# EAGLE design button_control_esp32 (EAGLE 9.4.2)

## Sheet 1 of 7
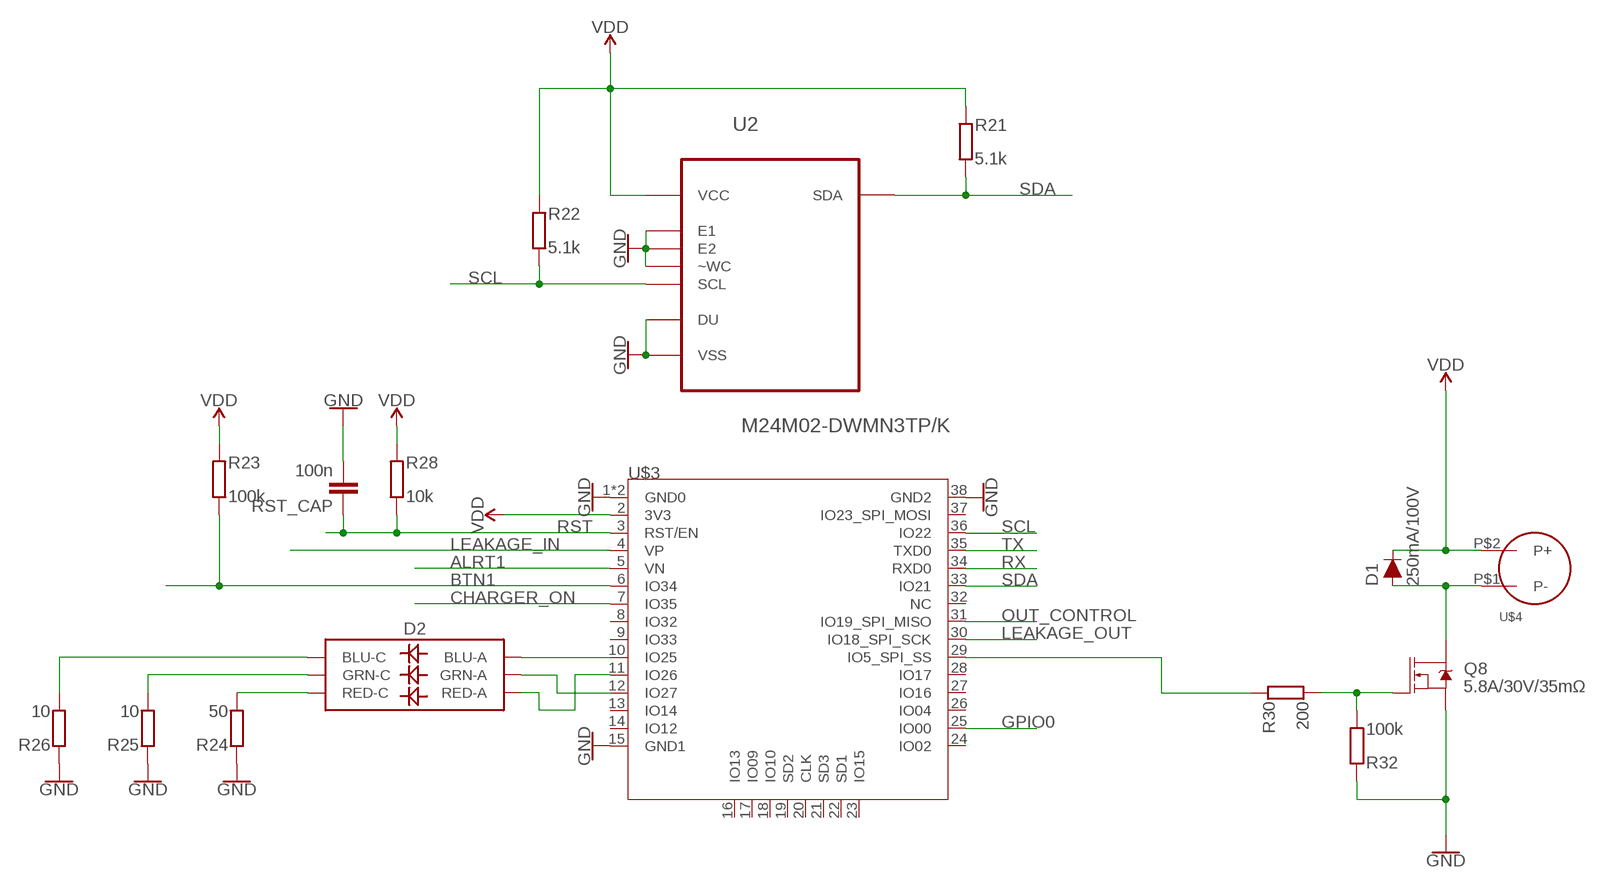
[diagram p0: schematic, sheet 1]

### Parts
D1  250mA/100V  DIODE-BAS16J  [SOD-323]
D2  LED-RGBNO_IC  [LED-TRICOLOR-5050]
Q8  5.8A/30V/35mΩ  MOSFET-NCH-AO3404A  [SOT23-3]
R21  5.1k  R-EU_R0603  [R0603]
R22  5.1k  R-EU_R0603  [R0603]
R23  100k  R-EU_R0603  [R0603]
R24  50  R-EU_R0603  [R0603]
R25  10  R-EU_R0603  [R0603]
R26  10  R-EU_R0603  [R0603]
R28  10k  R-EU_R0603  [R0603]
R30  200  R-EU_R0603  [R0603]
R32  100k  R-EU_R0603  [R0603]
RST_CAP  100n  C-EUC0603  [C0603]
U2  M24M02-DWMN3TP/K  [SOIC127P600X175-8N]
U$3  ESP32  [TTGO_ESP32]
U$4  VIBRO  [VIBRO]

### Nets
ALRT1: U$3.5(VN) ; also sheet 5
BTN1: R23.1 U$3.6(IO34) ; also sheet 7
CHARGER_ON: U$3.7(IO35) ; also sheet 6
GND [PWR]: Q8.2(S) R24.2 R25.2 R26.2 R32.2 RST_CAP.2 U2.1(DU) U2.2(E1) U2.3(E2) U2.4(VSS) U2.7(~WC) U$3.1(GND0) U$3.15(GND1) U$3.38(GND2) U$3.P$1(GND0) ; also sheet 2,3,4,6,7
GPIO0: U$3.25(IO00) ; also sheet 7
LEAKAGE_IN: U$3.4(VP) ; also sheet 3
LEAKAGE_OUT: U$3.30(IO18_SPI_SCK) ; also sheet 3
N$4: D2.3(BLU-A) U$3.10(IO25)
N$12: D2.1(GRN-A) U$3.12(IO27)
N$19: D2.2(RED-A) U$3.11(IO26)
N$24: Q8.1(G) R30.1 R32.1
N$30: R30.2 U$3.29(IO5_SPI_SS)
N$31: D2.4(BLU-C) R26.1
N$33: D2.6(GRN-C) R25.1
N$34: D2.5(RED-C) R24.1
N$35: D1.A Q8.3(D) U$4.P$1(P-)
OUT_CONTROL: U$3.31(IO19_SPI_MISO) ; also sheet 6
RST: R28.1 RST_CAP.1 U$3.3(RST/EN) ; also sheet 2,7
RX: U$3.34(RXD0) ; also sheet 7
SCL: R22.1 U2.6(SCL) U$3.36(IO22) ; also sheet 5
SDA: R21.1 U2.5(SDA) U$3.33(IO21) ; also sheet 5
TX: U$3.35(TXD0) ; also sheet 7
VDD [PWR]: D1.C R21.2 R22.2 R23.2 R28.2 U2.8(VCC) U$3.2(3V3) U$4.P$2(P+) ; also sheet 2,3,5,6,7
Unconnected: U$3.8(IO32) U$3.9(IO33) U$3.13(IO14) U$3.14(IO12) U$3.16(IO13) U$3.17(IO09) U$3.18(IO10) U$3.19(SD2) U$3.20(CLK) U$3.21(SD3) U$3.22(SD1) U$3.23(IO15) U$3.24(IO02) U$3.26(IO04) U$3.27(IO16) U$3.28(IO17) U$3.32(NC) U$3.37(IO23_SPI_MOSI)

## Sheet 2 of 7: POWER
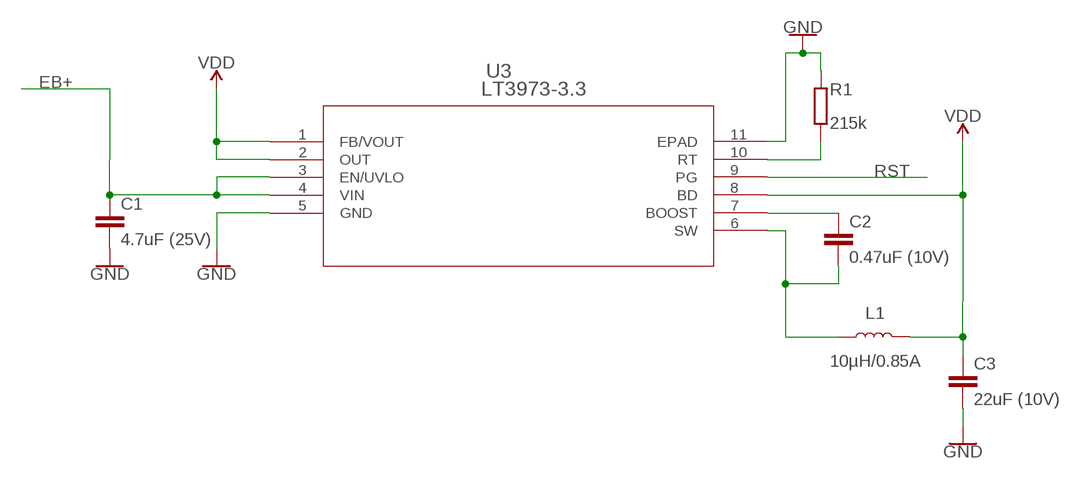
[diagram p1: schematic, sheet 2]

### Parts
C1  4.7uF (25V)  C-EUC1206  [C1206]
C2  0.47uF (10V)  C-EUC0603K  [C0603K]
C3  22uF (10V)  C-EUC1206  [C1206]
L1  10µH/0.85A  INDUCTOR-CDRH-4.7UH  [INDUCTOR_4.7UH]
R1  215k  R-EU_R0603  [R0603]
U3  LT3973-3.3  LT3973IDDPBF  [DFN-10_DD]

### Nets
BOOST: C2.1 U3.7(BOOST)
EB+: C1.1 U3.3(EN/UVLO) U3.4(VIN) ; also sheet 3,4,6,7
GND [PWR]: C1.2 C3.2 R1.2 U3.5(GND) U3.11(EPAD) ; also sheet 1,3,4,6,7
RST: U3.9(PG) ; also sheet 1,7
RT: R1.1 U3.10(RT)
SW [PWR]: C2.2 L1.P$1 U3.6(SW)
VDD [PWR]: C3.1 L1.P$2 U3.1(FB/VOUT) U3.2(OUT) U3.8(BD) ; also sheet 1,3,5,6,7

## Sheet 3 of 7: LEAKAGE
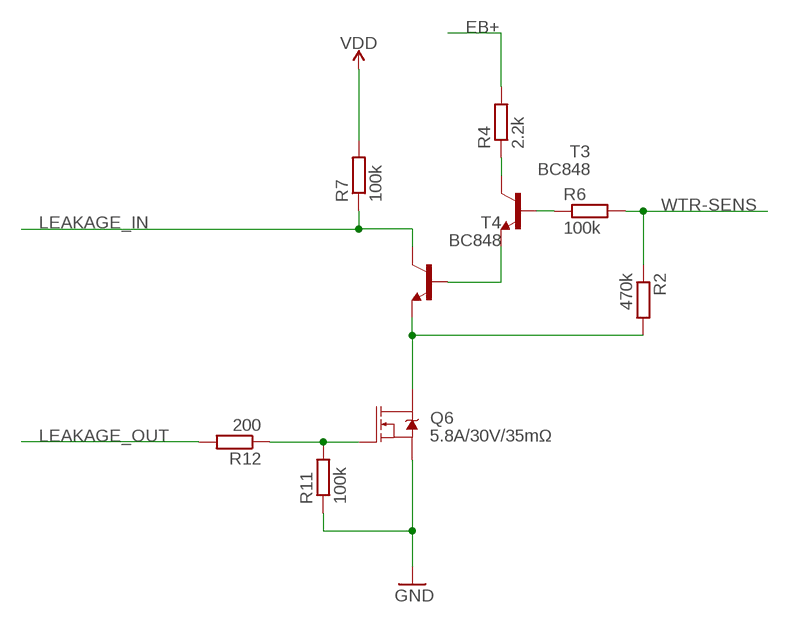
[diagram p2: schematic, sheet 3]

### Parts
Q6  5.8A/30V/35mΩ  MOSFET-NCH-AO3404A  [SOT23-3]
R2  470k  R-EU_R0603  [R0603]
R4  2.2k  R-EU_R0603  [R0603]
R6  100k  R-EU_R0603  [R0603]
R7  100k  R-EU_R0603  [R0603]
R11  100k  R-EU_R0603  [R0603]
R12  200  R-EU_R0603  [R0603]
T3  BC848  [SOT23]
T4  BC848  [SOT23]

### Nets
EB+: R4.2 ; also sheet 2,4,6,7
GND [PWR]: Q6.2(S) R11.1 ; also sheet 1,2,4,6,7
LEAKAGE_IN: R7.1 T4.3(C) ; also sheet 1
LEAKAGE_OUT: R12.2 ; also sheet 1
N$1: T3.2(E) T4.1(B)
N$2: R6.1 T3.1(B)
N$3: Q6.3(D) R2.2 T4.2(E)
VDD [PWR]: R7.2 ; also sheet 1,2,5,6,7
WTR-SENS: R2.1 R6.2 ; also sheet 7
WTR_MEASURE_ON1: Q6.1(G) R11.2 R12.1
WTR_MEASURE_PULLUP1: R4.1 T3.3(C)

## Sheet 4 of 7: BMS
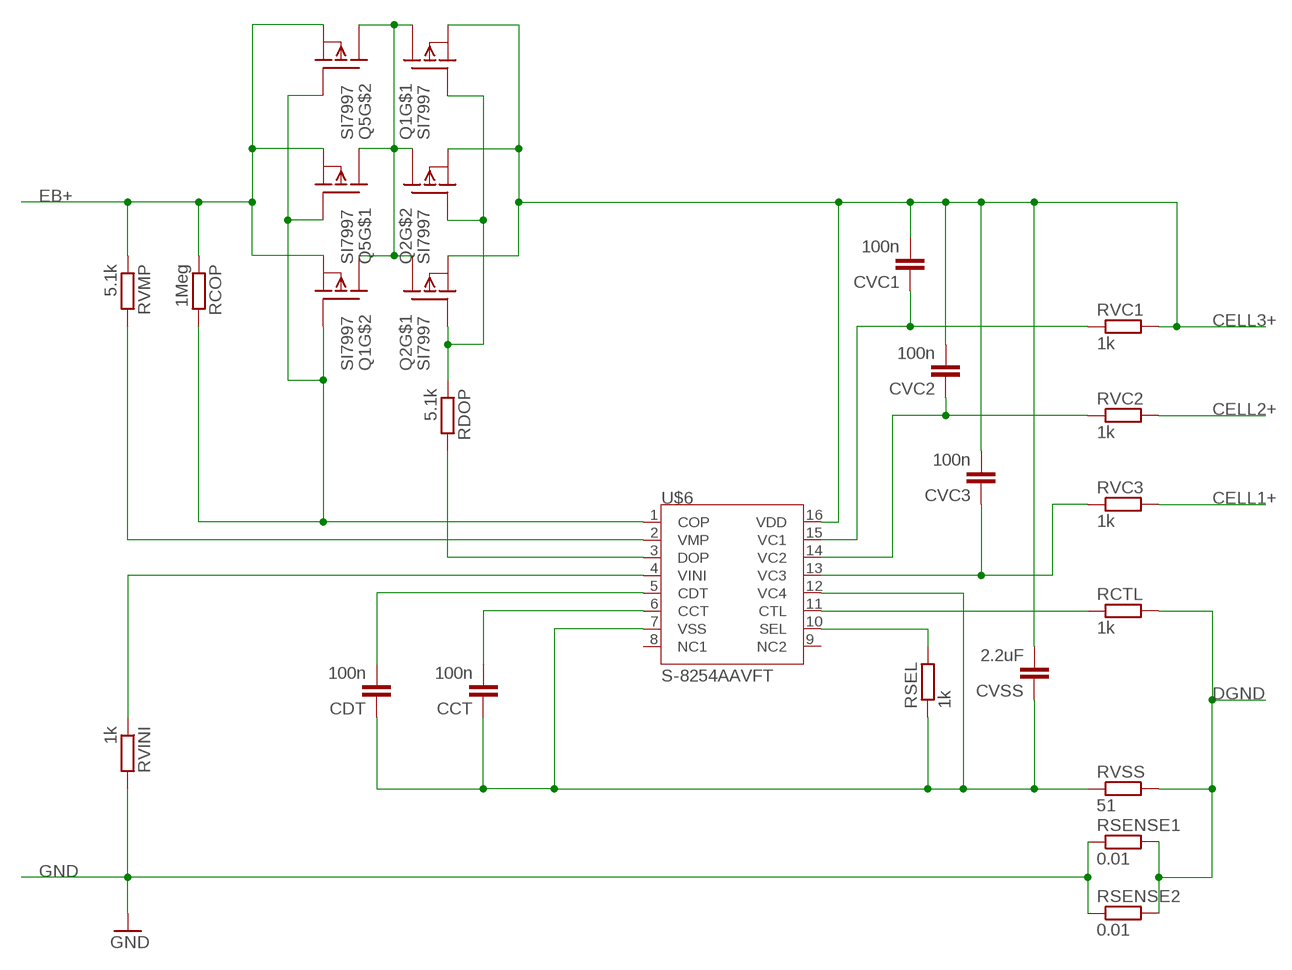
[diagram p3: schematic, sheet 4]

### Parts
CCT  100n  C-EUC0603  [C0603]
CDT  100n  C-EUC0603  [C0603]
CVC1  100n  C-EUC0603  [C0603]
CVC2  100n  C-EUC0603  [C0603]
CVC3  100n  C-EUC0603  [C0603]
CVSS  2.2uF  C-EUC0805  [C0805]
Q1  SI7997  [POWERPAK]
Q2  SI7997  [POWERPAK]
Q5  SI7997  [POWERPAK]
RCOP  1Meg  R-EU_R0603  [R0603]
RCTL  1k  R-EU_R0603  [R0603]
RDOP  5.1k  R-EU_R0603  [R0603]
RSEL  1k  R-EU_R0603  [R0603]
RSENSE1  0.01  R-EU_R2512  [R2512]
RSENSE2  0.01  R-EU_R2512  [R2512]
RVC1  1k  R-EU_R0603  [R0603]
RVC2  1k  R-EU_R0603  [R0603]
RVC3  1k  R-EU_R0603  [R0603]
RVINI  1k  R-EU_R0603  [R0603]
RVMP  5.1k  R-EU_R0603  [R0603]
RVSS  51  R-EU_R0603  [R0603]
U$6  S-8254AAVFT  S-8254A  [TSSOP-16]

### Nets
CELL1+: RVC3.2 ; also sheet 5,7
CELL2+: RVC2.2 ; also sheet 5,7
CELL3+: CVC1.2 CVC2.2 CVC3.2 CVSS.2 Q1.1(S) Q2.1(S) Q2.3(S) RVC1.2 U$6.16(VDD) ; also sheet 5,7
DGND: RCTL.2 RSENSE1.2 RSENSE2.2 RVSS.2 ; also sheet 5,7
EB+: Q1.3(S) Q5.1(S) Q5.3(S) RCOP.1 RVMP.1 ; also sheet 2,3,6,7
GND [PWR]: RSENSE1.1 RSENSE2.1 RVINI.2 ; also sheet 1,2,3,6,7
N$8: RDOP.2 U$6.3(DOP)
N$9: Q1.4(G) Q5.2(G) Q5.4(G) RCOP.2 U$6.1(COP)
N$10: Q1.2(G) Q2.2(G) Q2.4(G) RDOP.1
N$17: RVMP.2 U$6.2(VMP)
N$18: RSEL.2 U$6.10(SEL)
N$20: RVINI.1 U$6.4(VINI)
N$21: CDT.2 U$6.5(CDT)
N$22: CCT.2 U$6.6(CCT)
N$23: CCT.1 CDT.1 CVSS.1 RSEL.1 RVSS.1 U$6.7(VSS) U$6.12(VC4)
N$25: RCTL.1 U$6.11(CTL)
N$26: Q1.5(D) Q1.5_6(D) Q1.6(D) Q1.7(D) Q1.7_8(D) Q1.8(D) Q2.5(D) Q2.5_6(D) Q2.6(D) Q2.7(D) Q2.7_8(D) Q2.8(D) Q5.5(D) Q5.5_6(D) Q5.6(D) Q5.7(D) Q5.7_8(D) Q5.8(D)
N$27: CVC3.1 RVC3.1 U$6.13(VC3)
N$28: CVC2.1 RVC2.1 U$6.14(VC2)
N$29: CVC1.1 RVC1.1 U$6.15(VC1)
Unconnected: U$6.8(NC1) U$6.9(NC2)

## Sheet 5 of 7: GAUGE
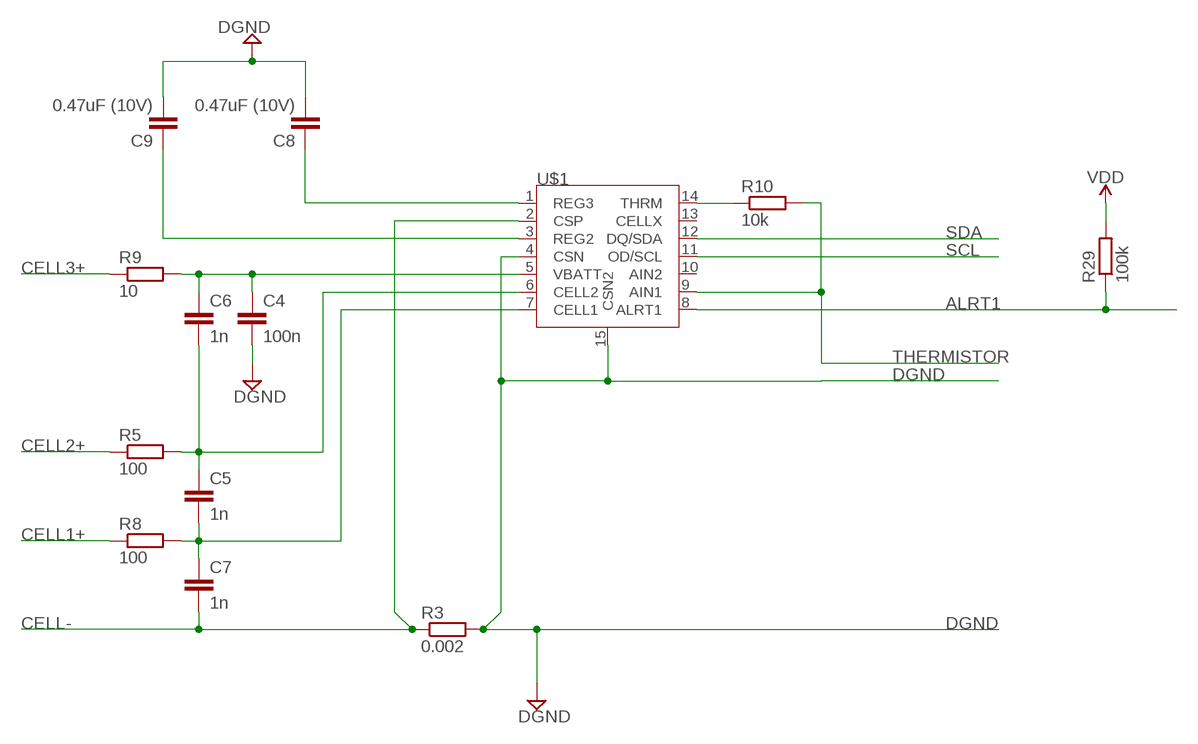
[diagram p4: schematic, sheet 5]

### Parts
C4  100n  C-EUC0603  [C0603]
C5  1n  C-EUC0603  [C0603]
C6  1n  C-EUC0603  [C0603]
C7  1n  C-EUC0603  [C0603]
C8  0.47uF (10V)  C-EUC0603K  [C0603K]
C9  0.47uF (10V)  C-EUC0603K  [C0603K]
R3  0.002  R-EU_R2512  [R2512]
R5  100  R-EU_R0805  [R0805]
R8  100  R-EU_R0805  [R0805]
R9  10  R-EU_R0603  [R0603]
R10  10k  R-EU_R0603  [R0603]
R29  100k  R-EU_R0603  [R0603]
U$1  MAX17205G  [SON40P300X300X80-15N230X170]

### Nets
ALRT1: R29.1 U$1.8(ALRT1) ; also sheet 1
CELL1+: R8.1 ; also sheet 4,7
CELL2+: R5.1 ; also sheet 4,7
CELL3+: R9.1 ; also sheet 4,7
CELL-: C7.2 R3.1 U$1.2(CSP) ; also sheet 7
DGND: C4.2 C8.2 C9.2 R3.2 U$1.4(CSN) U$1.15(CSN2) ; also sheet 4,7
N$5: C4.1 C6.1 R9.2 U$1.5(VBATT)
N$6: C5.1 C6.2 R5.2 U$1.6(CELL2)
N$7: C5.2 C7.1 R8.2 U$1.7(CELL1)
N$11: R10.1 U$1.14(THRM)
N$13: C8.1 U$1.1(REG3)
N$14: C9.1 U$1.3(REG2)
SCL: U$1.11(OD/SCL) ; also sheet 1
SDA: U$1.12(DQ/SDA) ; also sheet 1
THERMISTOR: R10.2 U$1.9(AIN1) ; also sheet 7
VDD [PWR]: R29.2 ; also sheet 1,2,3,6,7
Unconnected: U$1.10(AIN2) U$1.13(CELLX)

## Sheet 6 of 7: SWITCH
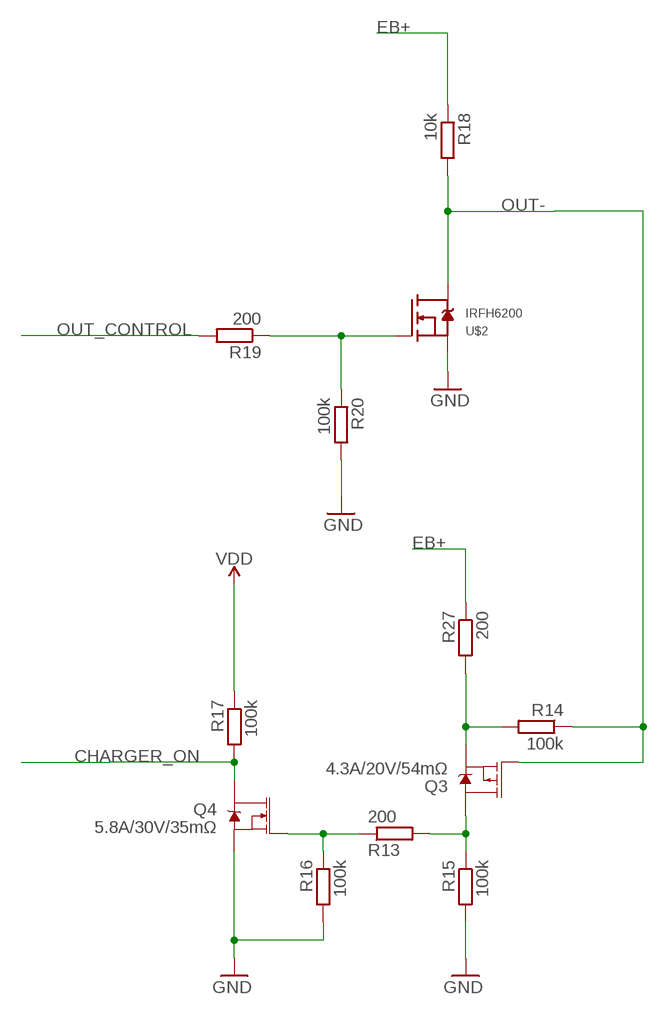
[diagram p5: schematic, sheet 6]

### Parts
Q3  4.3A/20V/54mΩ  MOSFET_PCH-IRLML2244  [SOT23-3]
Q4  5.8A/30V/35mΩ  MOSFET-NCH-AO3404A  [SOT23-3]
R13  200  R-EU_R0603  [R0603]
R14  100k  R-EU_R0603  [R0603]
R15  100k  R-EU_R0603  [R0603]
R16  100k  R-EU_R0603  [R0603]
R17  100k  R-EU_R0603  [R0603]
R18  10k  R-EU_R0603  [R0603]
R19  200  R-EU_R0603  [R0603]
R20  100k  R-EU_R0603  [R0603]
R27  200  R-EU_R0603  [R0603]
U$2  IRFH6200  [PQFN]

### Nets
CHARGER_ON: Q4.3(D) R17.2 ; also sheet 1
EB+: R18.1 R27.1 ; also sheet 2,3,4,7
GND [PWR]: Q4.2(S) R15.2 R16.2 R20.2 U$2.1(S) U$2.2(S) U$2.3(S) ; also sheet 1,2,3,4,7
N$15: Q3.3(D) R13.2 R15.1
N$16: Q4.1(G) R13.1 R16.1
N$32: Q3.2(S) R14.2 R27.2
OUT-: Q3.1(G) R14.1 R18.2 U$2.5(D) U$2.6(D) U$2.7(D) U$2.8(D) U$2.9(D) ; also sheet 7
OUT_BASE: R19.1 R20.1 U$2.4(G)
OUT_CONTROL: R19.2 ; also sheet 1
VDD [PWR]: R17.1 ; also sheet 1,2,3,5,7

## Sheet 7 of 7: CONN
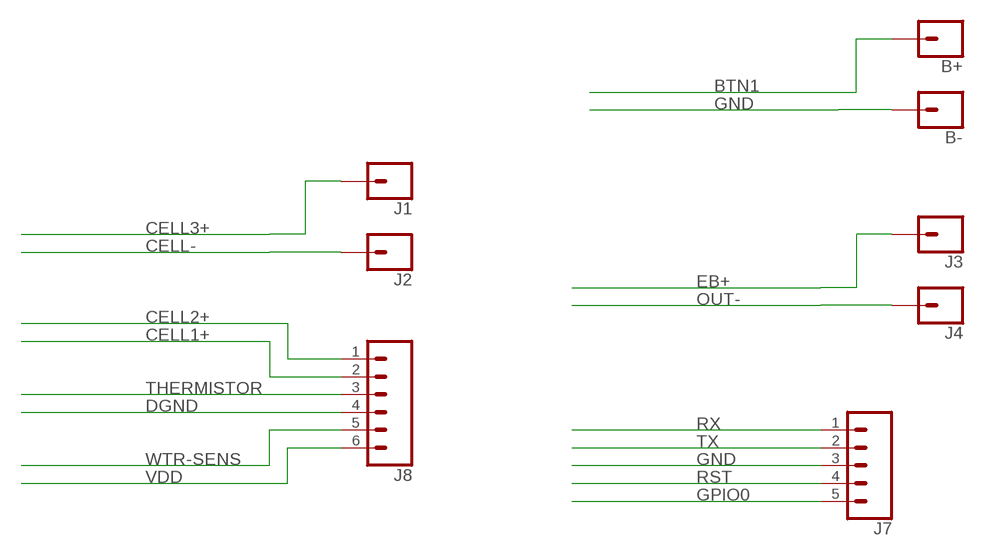
[diagram p6: schematic, sheet 7]

### Parts
B+  CONN_01  [1X01]
B-  CONN_01  [1X01]
J1  CONN_01PTH_2MM  [1X01_2MM]
J2  CONN_01PTH_2MM  [1X01_2MM]
J3  CONN_01PTH_2MM  [1X01_2MM]
J4  CONN_01PTH_2MM  [1X01_2MM]
J7  CONN_051.27MM  [1X05_1.27MM]
J8  CONN_061.27MM  [1X06_1.27MM]

### Nets
BTN1: B+.1 ; also sheet 1
CELL1+: J8.2 ; also sheet 4,5
CELL2+: J8.1 ; also sheet 4,5
CELL3+: J1.1 ; also sheet 4,5
CELL-: J2.1 ; also sheet 5
DGND: J8.4 ; also sheet 4,5
EB+: J3.1 ; also sheet 2,3,4,6
GND [PWR]: B-.1 J7.3 ; also sheet 1,2,3,4,6
GPIO0: J7.5 ; also sheet 1
OUT-: J4.1 ; also sheet 6
RST: J7.4 ; also sheet 1,2
RX: J7.1 ; also sheet 1
THERMISTOR: J8.3 ; also sheet 5
TX: J7.2 ; also sheet 1
VDD [PWR]: J8.6 ; also sheet 1,2,3,5,6
WTR-SENS: J8.5 ; also sheet 3

## Library data of the parts
B+ B- J1-J4 = SparkFun-Connectors:CONN_01: Single connection point. Often used as Generic Header-pin footprint for 0.1 inch spaced/style header connections On any of the 0.1 inch spaced packages, you can populate with these: Break Away Headers - Straight <https://www.sparkfun.com/products/116> (PRT-00116) Break Away Male Headers - Right Angle <https://www.sparkfun.com/products/553> (PRT-00553) Female Headers <https://www.sparkfun.com/products/115> (PRT-00115) Break Away Headers - Machine Pin <https://www.sparkfun.com/products/117> (PRT-00117) Break Away Female Headers - Swiss Machine Pin <https://www.sparkfun.com/products/743> (PRT-00743) This device is also useful as a general connection point to wire up your design to another part of your project. Our various solder wires solder well into these plated through hole pads. Hook-Up Wire - Assortment (Stranded, 22 AWG) <https://www.sparkfun.com/products/11375> (PRT-11375) Hook-Up Wire - Assortment (Solid Core, 22 AWG) <https://www.sparkfun.com/products/11367> (PRT-11367) View the entire wire category on our website here <https://www.sparkfun.com/categories/141> Special notes: SMTSO-256-ET is a "flush mount" nut for a 4-40 screw. We mostly use this on specialty testbeds; it is a nice way to connect hardware to your PCB at an adjustable hieght. Also note, the SNAP packages are for using a snappable style connector. We sell a baggie of snaps and they are also used on two LilyPad designs: Snap Assortment - 30 pack (male and female) <https://www.sparkfun.com/products/11347> (DEV-11347) LilyPad Arduino SimpleSnap <https://www.sparkfun.com/products/10941> (DEV-10941) LilyPad SimpleSnap Protoboard <https://www.sparkfun.com/products/10940> (DEV-10940)
C1-C9 CCT CDT CVC1-CVC3 CVSS RST_CAP = resistor:C-EU: CAPACITOR, European symbol
D1 = SparkFun-DiscreteSemi:DIODE: Diode These are standard reverse protection diodes and small signal diodes. SparkFun Products: SparkFun SparkPunk Sound Kit <https://www.sparkfun.com/products/11177> SparkFun ESP8266 Thing <https://www.sparkfun.com/products/13231>; PROD_ID: DIO-09646
D2 = SparkFun-LED:LED-RGB: LED-RGB 6 pin RGB LED (no common connector) Packages: PLCC-6 LED-TRICOLOR-5050 - No built-in IC SparkFun Products: Digital Sandbox <https://www.sparkfun.com/products/12651> LED- SMD RGB <https://www.sparkfun.com/products/10866>; PROD_ID: DIO-10298
J7 = SparkFun-Connectors:CONN_05: Multi connection point. Often used as Generic Header-pin footprint for 0.1 inch spaced/style header connections On any of the 0.1 inch spaced packages, you can populate with these: Break Away Headers - Straight <https://www.sparkfun.com/products/116> (PRT-00116) Break Away Male Headers - Right Angle <https://www.sparkfun.com/products/553> (PRT-00553) Female Headers <https://www.sparkfun.com/products/115> (PRT-00115) Break Away Headers - Machine Pin <https://www.sparkfun.com/products/117> (PRT-00117) Break Away Female Headers - Swiss Machine Pin <https://www.sparkfun.com/products/743> (PRT-00743) For SCREWTERMINALS and SPRING TERMINALS visit here: Screw Terimnals on SparkFun.com <https://www.sparkfun.com/search/results?term=Screw+Terminals> (5mm/3.5mm/2.54mm spacing) This device is also useful as a general connection point to wire up your design to another part of your project. Our various solder wires solder well into these plated through hole pads. Hook-Up Wire - Assortment (Stranded, 22 AWG) <https://www.sparkfun.com/products/11375> (PRT-11375) Hook-Up Wire - Assortment (Solid Core, 22 AWG) <https://www.sparkfun.com/products/11367> (PRT-11367) View the entire wire category on our website here <https://www.sparkfun.com/categories/141> Special notes: Molex polarized connector foot print use with SKU : PRT-08231 with associated crimp pins and housings. 1MM SMD Version SKU: PRT-10208
J8 = SparkFun-Connectors:CONN_06: Multi connection point. Often used as Generic Header-pin footprint for 0.1 inch spaced/style header connections On any of the 0.1 inch spaced packages, you can populate with these: Break Away Headers - Straight <https://www.sparkfun.com/products/116> (PRT-00116) Break Away Male Headers - Right Angle <https://www.sparkfun.com/products/553> (PRT-00553) Female Headers <https://www.sparkfun.com/products/115> (PRT-00115) Break Away Headers - Machine Pin <https://www.sparkfun.com/products/117> (PRT-00117) Break Away Female Headers - Swiss Machine Pin <https://www.sparkfun.com/products/743> (PRT-00743) Arduino Stackable Header - 6 Pin <https://www.sparkfun.com/products/9280> (PRT-09280) For SCREWTERMINALS and SPRING TERMINALS visit here: Screw Terimnals on SparkFun.com <https://www.sparkfun.com/search/results?term=Screw+Terminals> (5mm/3.5mm/2.54mm spacing) This device is also useful as a general connection point to wire up your design to another part of your project. Our various solder wires solder well into these plated through hole pads. Hook-Up Wire - Assortment (Stranded, 22 AWG) <https://www.sparkfun.com/products/11375> (PRT-11375) Hook-Up Wire - Assortment (Solid Core, 22 AWG) <https://www.sparkfun.com/products/11367> (PRT-11367) View the entire wire category on our website here <https://www.sparkfun.com/categories/141>
L1 = SparkFun-Coils:INDUCTOR: Inductors Resist changes in electrical current. Basically a coil of wire. SparkFun Products: SparkFun Load Cell Amplifier - HX711 <https://www.sparkfun.com/products/13879> IOIO-OTG - V2.2 <https://www.sparkfun.com/products/13613>; PN: CDRH2D18/HPNP-100NC; PROD_ID: NDUC-10146; VALUE: 4.7µH/±30%/1.2A
Q1 Q2 Q5 = SI7997:SI7997: P-Channel Enhancement MOSFET -60V; 60A; 0,020Ohm
Q3 = SparkFun-DiscreteSemi:MOSFET_PCH: P-channel MOSFETs Voltage controlled devices that allow control of high current outputs. SparkFun Products: SparkFun ESP32 Thing <https://www.sparkfun.com/products/13907> SparkFun ESP8266 Thing <https://www.sparkfun.com/products/13231>; PROD_ID: TRANS-11153
Q4 Q6 Q8 = SparkFun-DiscreteSemi:MOSFET-NCH: N-channel MOSFETs Voltage controlled devices that allow control of high current outputs. SparkFun Products: SparkFun OpenScale <https://www.sparkfun.com/products/13261> SparkFun Digital Sandbox <https://www.sparkfun.com/products/12651> SparkFun Monster Moto Shield <https://www.sparkfun.com/products/10182> SparkFun MOSFET Power Controller <https://www.sparkfun.com/products/11214>; PROD_ID: TRANS-12988
R1 R3 R5 R8-R10 R21-R26 R28-R30 R32 RCOP RCTL RDOP RSEL RSENSE1 RSENSE2 RVC1-RVC3 RVINI RVMP RVSS = resistor:R-EU_: RESISTOR, European symbol
R2 R4 R6 R7 R11-R20 R27 = rcl:R-EU_: RESISTOR, European symbol; SPICEPREFIX: R
T3 = transistor-neu-to92:BC848: NPN TRANSISTOR
T4 = transistor-neu-to92:BC848: NPN TRANSISTOR; SPICEPREFIX: Q
U2 = M24M02-DWMN3TP_K:M24M02-DWMN3TP/K: 1 Mbit serial I²C bus EEPROM; DESCRIPTION: Automotive 2-Mbit serial I²C bus EEPROM with 1 MHz clock; DIGI-KEY_PART_NUMBER: 497-16238-1-ND; DIGI-KEY_PURCHASE_URL: https://www.digikey.com.ua/product-detail/en/stmicroelectronics/M24M02-DWMN3TP-K/497-16238-1-ND/5764577?utm_source=snapeda&utm_medium=aggregator&utm_campaign=symbol; MF: STMicroelectronics; MP: M24M02-DWMN3TP/K; PACKAGE: SO-8 STMicroelectronics
U3 = LT3973IDDPBF:LT3973IDDPBF; DESCRIPTION: LT3973 - 42V, 750mA Step-Down Regulator with 2.5μA Quiescent Current and Integrated Diodes; DIGI-KEY_PART_NUMBER: LT3973IDD#PBF-ND; DIGI-KEY_PURCHASE_URL: https://www.digikey.com.ua/product-detail/en/linear-technology-analog-devices/LT3973IDD-PBF/LT3973IDD-PBF-ND/2786019?utm_source=snapeda&utm_medium=aggregator&utm_campaign=symbol; MF: Linear Technology; MP: LT3973IDD#PBF; PACKAGE: DFN-10 Linear Technology
U$1 = SON40P300X300X80-15N230X170:MAX17205G
U$2 = IRFH6200:IRFH6200
U$3 = esp32_ttgo:ESP32
U$4 = vibro:VIBRO
U$6 = S8254A:S-8254A

## Net classes
0 default: width 0.152 mm, drill 0.3 mm, clearance 0.152 mm
1 PWR: width 0.381 mm, drill 0.4 mm, clearance 0.152 mm

## Board
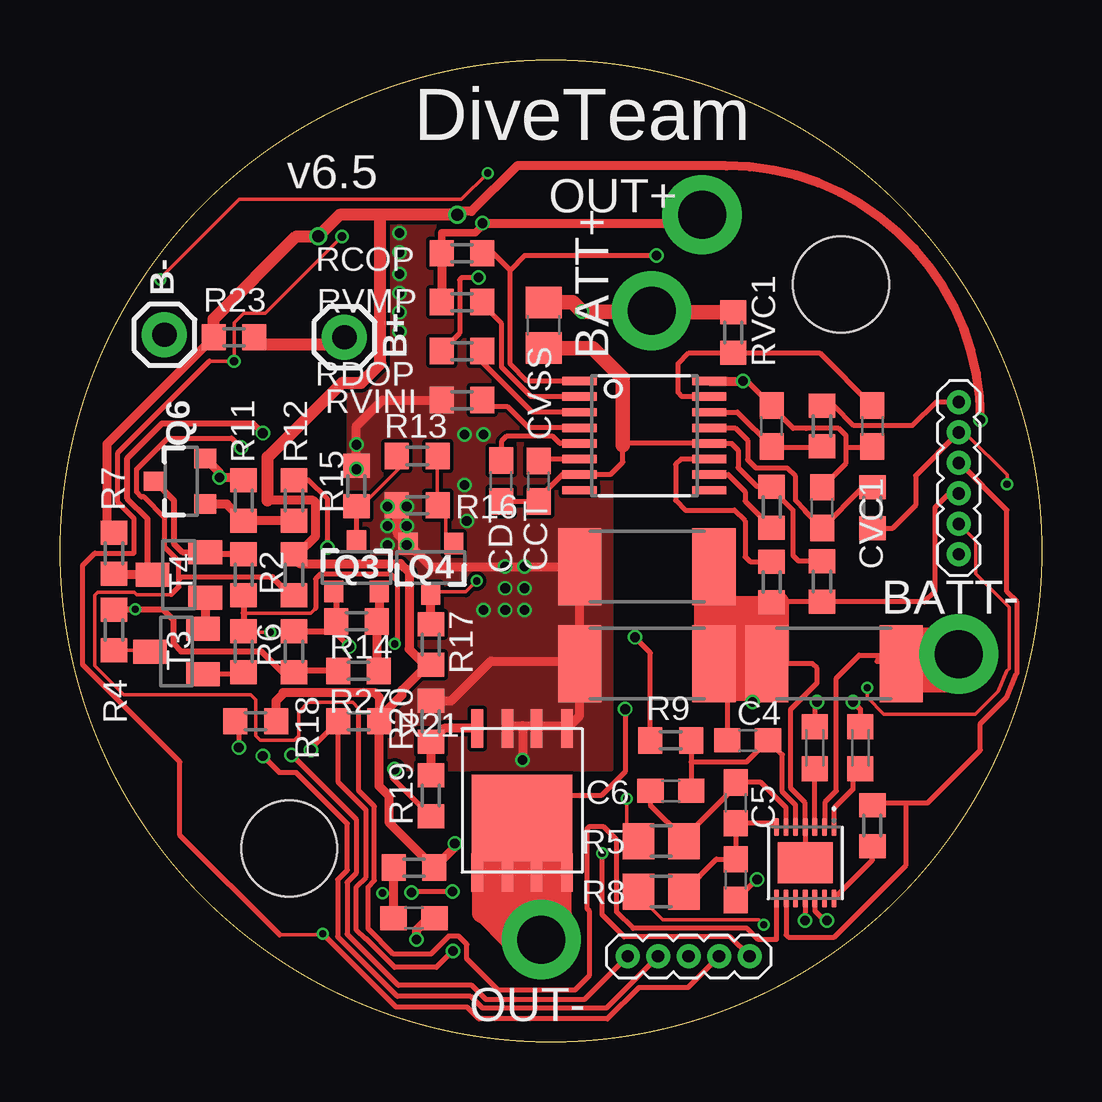
[diagram p7: board, top side]
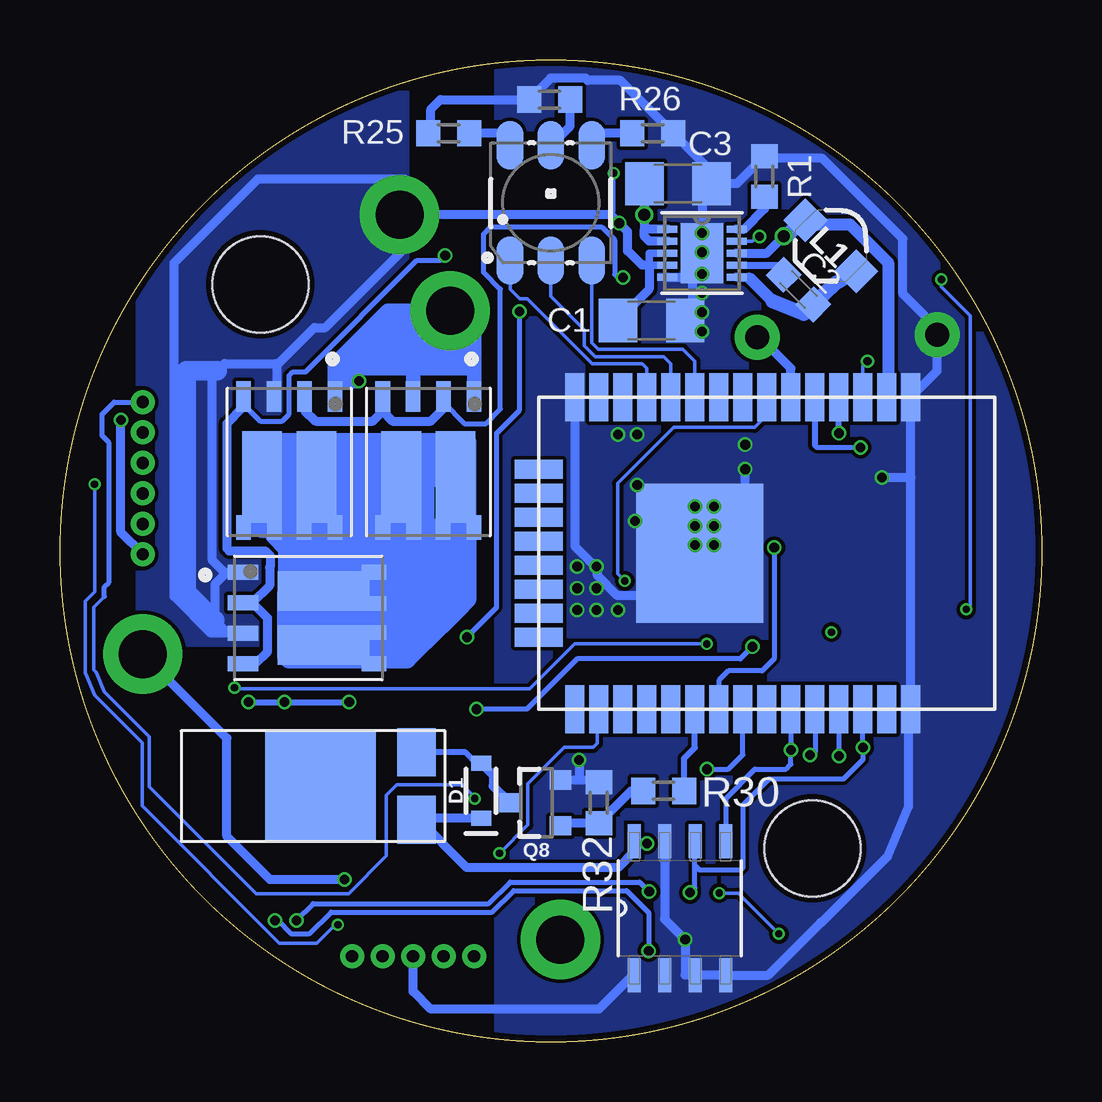
[diagram p8: board, bottom side, seen from below]

Size 40.9 x 40.9 mm. Coordinates in mm from the lower left corner, seen from the top.
Outline: circle at 20.45,20.45 radius 20.45
Copper layers (1*16): Top 0.035mm / dielectric 1.2mm / Bottom 0.035mm
Design rules "SeeedStudio_4layer_DRU_no_angle_20140221 *": minimum track width 6mil, minimum drill 0.3mm, track to track 6mil, track to pad 6mil, pad to pad 6mil, via to via 6mil, smd to smd 0mil, copper to edge 10mil, drill to drill 8mil, minimum pad ring 6mil, minimum via ring 4mil, stop-mask expansion 4mil, vias tented up to drill 25mil, thermal gap 10mil
Holes 4 mm at 32.55,31.55 9.55,8.05

### Footprints (pad centres in the part's own frame; a part is rotated, then mirrored left to right if it is on the bottom)
1X01 = drill 1.016 pad 1.88: 1 0,0
C1206 = smd 1.6 x 1.8: 1 -1.4,0; 2 1.4,0
C0603K = smd 1.05 x 1.08: 1 -0.875,0; 2 0.875,0
C0603 = smd 1.1 x 1: 1 -0.85,0; 2 0.85,0
C0805 = smd 1.3 x 1.5: 1 -0.95,0; 2 0.95,0
SOD-323 = smd 0.63 x 0.83: A 1.15,0; C -1.15,0
LED-TRICOLOR-5050 = smd 2 x 1.1: 1 -2.4,1.7; 2 -2.4,0; 3 -2.4,-1.7; 4 2.4,-1.7; 5 2.4,0; 6 2.4,1.7
1X01_2MM = drill 2 pad 3.302: 1 0,0
1X05_1.27MM = drill 0.508 pad 1: 1 0,0; 2 1.27,0; 3 2.54,0; 4 3.81,0; 5 5.08,0
1X06_1.27MM = drill 0.508 pad 1: 1 0,0; 2 1.27,0; 3 2.54,0; 4 3.81,0; 5 5.08,0; 6 6.35,0
INDUCTOR_4.7UH = smd 1.3 x 1.3: P$1 -1.5,0; P$2 1.5,0
POWERPAK = smd 1.27 x 0.61: 1 -2.732,1.905; 2 -2.732,0.635; 3 -2.732,-0.635; 4 -2.732,-1.905 | smd 1.02 x 0.61: 5 2.732,-1.905; 6 2.732,-0.61; 7 2.732,0.61; 8 2.732,1.905 | smd 3.81 x 1.65: 5_6 0.627,-1.13; 7_8 0.627,1.13
SOT23-3 = smd 0.8 x 0.9: 1 -0.95,-1; 2 0.95,-1; 3 0,1.1
R0603 = smd 1 x 1.1: 1 -0.85,0; 2 0.85,0
R2512 = smd 1.8 x 3.2: 1 -2.8,0; 2 2.8,0
R0805 = smd 1.3 x 1.5: 1 -0.95,0; 2 0.95,0
SOT23 = smd 1 x 1.4: 1 -0.95,-1.1; 2 0.95,-1.1; 3 0,1.1
SOIC127P600X175-8N = smd 1.422 x 0.533: 1 -2.794,1.905; 2 -2.794,0.635; 3 -2.794,-0.635; 4 -2.794,-1.905; 5 2.794,-1.905; 6 2.794,-0.635; 7 2.794,0.635; 8 2.794,1.905
DFN-10_DD = smd 0.813 x 0.305: 1 -1.448,1; 2 -1.448,0.5; 3 -1.448,0; 4 -1.448,-0.5; 5 -1.448,-1; 6 1.448,-1; 7 1.448,-0.5; 8 1.448,0; 9 1.448,0.5; 10 1.448,1 | smd 1.753 x 2.489: 11 0,0
SON40P300X300X80-15N230X170 = smd 0.76 x 0.22: 1 -1.485,1.2; 2 -1.485,0.8; 3 -1.485,0.4; 4 -1.485,0; 5 -1.485,-0.4; 6 -1.485,-0.8; 7 -1.485,-1.2; 8 1.485,-1.2; 9 1.485,-0.8; 10 1.485,-0.4; 11 1.485,0; 12 1.485,0.4; 13 1.485,0.8; 14 1.485,1.2 | smd 1.7 x 2.3: 15 0,0
PQFN = smd 1.6 x 0.48: 1 -3,1.865; 2 -3,0.595; 3 -3,-0.595; 4 -3,-1.865; 5 3,-1.865; 6 3,-0.595; 7 3,0.595; 8 3,1.865 | smd 3.6 x 4.2: 9 0.725,0
TTGO_ESP32 = smd 2 x 0.8: 1 -6.5,6; 2 -6.5,5; 3 -6.5,4; 4 -6.5,3; 5 -6.5,2; 6 -6.5,1; 7 -6.5,0; 8 -6.5,-1; 9 -6.5,-2; 10 -6.5,-3; 11 -6.5,-4; 12 -6.5,-5; 13 -6.5,-6; 14 -6.5,-7; 15 -6.5,-8; 24 6.5,-8; 25 6.5,-7; 26 6.5,-6; 27 6.5,-5; 28 6.5,-4; 29 6.5,-3; 30 6.5,-2; 31 6.5,-1; 32 6.5,0; 33 6.5,1; 34 6.5,2; 35 6.5,3; 36 6.5,4; 37 6.5,5; 38 6.5,6 | smd 0.8 x 2: 16 -3.5,-9.5; 17 -2.5,-9.5; 18 -1.5,-9.5; 19 -0.5,-9.5; 20 0.5,-9.5; 21 1.5,-9.5; 22 2.5,-9.5; 23 3.5,-9.5 | smd 5.8 x 5.3: P$1 0,-2.8
VIBRO = smd 2 x 1.6: P$1 1.4,-0.8; P$2 -1.4,-0.8 | smd 4.6 x 4.6: P$3 0,3.2
TSSOP-16 = smd 0.35 x 1.43: 1 -2.275,-2.7; 2 -1.625,-2.7; 3 -0.975,-2.7; 4 -0.325,-2.7; 5 0.325,-2.7; 6 0.975,-2.7; 7 1.625,-2.7; 8 2.275,-2.7; 9 2.275,2.7; 10 1.625,2.7; 11 0.975,2.7; 12 0.325,2.7; 13 -0.325,2.7; 14 -0.975,2.7; 15 -1.625,2.7; 16 -2.275,2.7

### Placement (x,y rotation side)
B+  11.85,29.35 0 top
B-  4.35,29.45 0 top
C1  16.25,30.05 0 bottom
C2  10.13,31.33 315 bottom
C3  15.15,35.75 0 bottom
C4  28.65,12.55 180 top
C5  28.15,9.95 270 top
C6  25.45,10.45 180 top
C7  28.15,6.75 270 top
C8  33.35,12.25 90 top
C9  31.45,12.25 90 top
CCT  19.95,23.35 90 top
CDT  18.39,23.36 90 top
CVC1  33.85,25.65 270 top
CVC2  29.65,25.65 90 top
CVC3  31.75,22.25 90 top
CVSS  20.15,29.85 90 top
D1  23.35,10.45 90 bottom
D2  20.45,34.95 90 bottom
J1  24.65,30.45 0 bottom
J2  37.45,16.15 270 top
J3  26.75,34.45 0 bottom
J4  20.05,4.25 270 top
J7  23.65,3.55 0 top
J8  37.45,26.65 270 top
L1  8.78,33.16 135 bottom
Q1  31.35,24.15 270 bottom
Q2  25.55,24.15 270 bottom
Q3  12.35,19.75 0 top
Q4  15.45,19.75 180 top
Q5  30.55,17.65 0 bottom
Q6  5.05,23.35 90 top
Q8  21.05,9.95 90 bottom
R1  11.55,36.05 90 bottom
R2  7.65,19.45 90 top
R3  32.25,15.75 180 top
R4  2.25,17.15 90 top
R5  25.05,8.35 0 top
R6  7.65,16.25 90 top
R7  2.25,20.35 90 top
R8  25.05,6.25 0 top
R9  25.45,12.55 0 top
R10  33.85,9 90 top
R11  7.65,22.55 270 top
R12  9.75,22.55 90 top
R13  14.89,24.4 180 top
R14  12.35,17.51 0 top
R15  12.35,23.15 90 top
R16  14.89,22.35 180 top
R17  15.45,16.55 90 top
R18  9.75,16.25 90 top
R19  15.45,10.25 270 top
R20  15.45,13.35 90 top
R21  12.45,13.35 0 top
R22  8.15,13.35 0 top
R23  7.25,29.35 180 top
R24  20.5,39.25 180 bottom
R25  24.7,37.85 180 bottom
R26  16.2,37.85 0 bottom
R27  12.44,15.45 0 top
R28  14.75,7.25 0 top
R29  9.75,19.45 90 top
R30  15.75,10.45 0 bottom
R32  18.45,9.95 90 bottom
RCOP  16.75,32.85 0 top
RCTL  29.65,19.15 270 top
RDOP  16.75,28.77 0 top
RSEL  29.65,22.27 270 top
RSENSE1  24.45,19.79 0 top
RSENSE2  24.45,15.75 0 top
RST_CAP  14.75,5.15 0 top
RVC1  28.05,29.55 90 top
RVC2  31.75,25.65 90 top
RVC3  33.85,22.25 270 top
RVINI  16.75,26.73 180 top
RVMP  16.75,30.81 0 top
RVSS  31.75,19.17 270 top
T3  4.85,16.25 90 top
T4  4.95,19.45 90 top
U2  15.07,5.56 90 bottom
U3  14.15,32.85 0 bottom
U$1  31.05,7.45 270 top
U$2  19.25,10.05 270 top
U$3  11.45,20.35 270 bottom
U$4  26.85,10.65 90 bottom
U$6  24.35,25.25 270 top

### Tracks (layer width: path | path; a pad name or v marks a point on that pad's centre or on a via)
ALRT1  (via drill 0.4)
  Top 0.152: 8.85,19.35 8.76,19.35 | 12.45,13.75 12.45,13.87 12.19,14.13 10.35,14.13 9.95,13.73 9.95,12.75 9.75,12.55 8.35,12.55 8.15,12.75 8.15,14.25 7.95,14.45 2.66,14.45 1.45,15.66 1.45,18.61 1.57,18.73 3.09,18.73 3.2,18.62 4.62,18.62
  Top 0.2: U$1.8 29.85,4.25 29.09,4.25 28.63,4.72 23.88,4.72 23.2,5.39 23.2,8.4 22.65,8.95 22.05,8.95 21.95,8.85 21.95,5.55 22.05,5.45 22.05,2.75 21.45,2.15 18.25,2.15 16.95,3.45 16.95,4.05 16.61,4.39 16.19,4.39 15.45,3.65 13.89,3.65 12.83,4.71 12.83,6.43 13.1,6.7 13.1,9.8 12.45,10.45 12.45,13.75 | 4.62,18.62 4.95,18.95 4.95,19.25 | 4.95,19.25 4.95,20.01 4.37,20.59 4.37,21.83 3.5,22.7 3.39,22.7 3.19,22.9 3.19,23.85 4.49,25.15 7.15,25.15 v7.55,24.75 | 8.76,19.35 8.31,19.35 8.3,19.35 5.05,19.35 4.95,19.25
  Top 0.254: 8.85,19.35 9.6,18.6 R29.1
  Bottom 0.2: v7.55,24.75 9.35,24.75 9.45,24.85
  Bottom 0.254: U$3.5 9.45,24.85
BOOST
  Bottom 0.152: 10.8,32.35 10.75,32.29 C2.1 | C2.1 10.77,31.97 10.74,32 C2.1
  Bottom 0.3: U3.7 10.8,32.35
BTN1
  Top 0.381: R23.1 8.1,29.05
  Top 0.508: 8.1,29.05 11.47,29.05 B+.1
  Bottom 0.381: B+.1 11.75,29.25 11.68,29.28 10.45,28.05 U$3.6
CELL1+  (via drill 0.3)
  Top 0.152: v29.32,4.87 29.12,5.07 25.12,5.07 24.1,6.09 R8.1 | v39.46,23.22 39.46,23.62 37.79,25.29 37.48,25.29 J8.2
  Top 0.2: J8.2 35.65,23.58 35.65,22.35 34.7,21.4 RVC3.2
  Bottom 0.152: v29.32,4.87 29.44,4.87 30.2,4.11 31.77,4.11 37.48,9.82 37.48,12.46 39.46,14.43 39.83,15.33 39.85,15.35 39.85,18.35 39.45,18.75 v39.46,23.22
CELL2+  (via drill 0.3)
  Top 0.152: v23.61,10.13 23.61,8.85 24.07,8.39 24.07,8.38 R5.1
  Top 0.2: J8.1 36.5,26.65 35.52,25.67 33.08,25.67 32.25,26.5 RVC2.2
  Bottom 0.152: v23.61,10.13 23.61,10.18 24.14,10.71 26.87,10.71 27.3,10.27 27.3,7.74 28.87,6.16 32.72,6.16 37.18,10.63 37.18,12.71 39.05,14.58 39.39,15.39 39.5,15.5 39.5,18.1 39.05,18.54
  Bottom 0.2: 39.05,18.54 39.05,18.95 38.85,19.15 38.85,24.95 39.15,25.25 39.15,26.15 38.65,26.65 J8.1
CELL3+  (via drill 0.4)
  Top 0.2: v28.45,27.52 28.62,27.52 29.38,26.77 | R9.1 24.6,16.2 v23.95,16.85 | CVC3.2 32.75,24.1 32.75,24.75 | 29.65,26.45 30.55,25.55 31.09,25.55 32.45,25.55 32.75,25.25 32.75,24.75 | CVC1.2 33.8,24.75 32.75,24.75
  Top 0.381: 29.65,26.45 CVC2.2 29.38,26.77 | U$6.16 v28.45,27.52
  Top 0.61: CVSS.2 21.37,30.8 v21.75,30.42 24.62,30.42 J1.1 24.7,30.4 RVC1.2
  Bottom 0.2: v21.75,30.42 21.75,26.31 22.7,25.36 22.7,18.1 v23.95,16.85
  Bottom 0.381: 23.64,29.45 24.45,30.25 J1.1 25.05,30.05 26.18,28.91 26.18,28.35 26.18,27.95 | Q1.1 29.45,27.55 | 29.45,27.55 29.45,27.65 29.45,28.05 29.45,28.25 27.25,30.45 26.05,30.45 25.65,30.45 | v28.45,27.52 29.42,27.52 29.45,27.55
  Bottom 0.61: 26.05,28.05 23.64,28.05 | 26.05,28.05 29.15,28.05 29.45,28.05 29.45,28.25 | 26.05,28.05 26.05,28.65 | 26.05,28.65 26.05,30.45 | 23.64,28.05 23.64,28.55 | 23.64,28.55 23.64,29.45 23.64,30.45 J1.1 | J1.1 25.65,30.45 | 25.65,30.45 26.18,30.45 26.18,28.35 | J1.1 24.65,28.55 | 24.65,28.55 24.05,28.55 | 24.05,28.55 23.64,28.55 | 24.65,28.55 25.05,28.55 | 25.05,28.55 27.05,28.55 | 27.05,28.55 27.75,28.55 | 27.75,28.55 28.35,28.55 | 29.45,28.25 28.65,28.25 28.35,28.55 | 29.45,27.65 29.45,27.52 v28.45,27.52 | Q2.3 26.18,27.95 | Q2.1 23.64,28.05 | Q1.1 29.45,28.25 | 24.05,28.55 24.05,30.25 24.45,30.25 | 25.05,28.55 25.05,30.05 | 26.05,28.65 25.65,28.65 25.65,30.45 | J1.1 27.25,30.45 29.45,28.25 | J1.1 26.45,30.45 28.35,28.55 | J1.1 25.85,30.45 27.75,28.55 | J1.1 25.15,30.45 27.05,28.55
CELL-  (via drill 0.4)
  Top 0.2: J2.1 35.35,16.15 34.35,16.15 34.3,16.1 | 34.3,16.1 34.04,15.84 R3.1 | U$1.2 31.89,8.97 31.89,9.99 32.35,10.45 32.35,15.15 33.3,16.1 34.3,16.1 | v29.05,6.75 29,6.75 C7.2
  Top 0.813: R3.1 35.22,15.95 37.05,15.95 37.05,14.95 34.85,14.95 34.85,15.55 | 34.85,15.55 34.85,16.85 36.65,16.85 36.65,16.15 35.35,16.15 | J2.1 37.45,15.55 34.85,15.55
  Bottom 0.381: J2.1 33.95,12.65 33.95,8.55 32.15,6.75 v29.05,6.75
CHARGER_ON  (via drill 0.3)
  Top 0.152: v17.37,19.2 16.91,18.74 15.61,18.74 Q4.3
  Top 0.381: R17.2 Q4.3
  Bottom 0.152: v17.37,19.2 17.67,19.5 17.67,23.26 15.33,25.6 11.96,25.6 11.5,26.05 11.5,26.81 U$3.7
DGND  (via drill 0.4)
  Top 0.2: J8.4 37.45,22.75 36.95,22.75 36.45,22.25 36.45,18.75 36.02,18.32 RVSS.2 30.05,18.32 29.96,18.32 29.67,18.32 RCTL.2 29.65,17.05 29.65,15.85 R3.2 | R3.2 28.55,15.75 28.45,15.75 | 28.55,16.05 27.85,16.05 27.55,16.05 27.35,15.85 | 27.35,15.85 RSENSE2.2 27.8,15.2 C4.2 | RSENSE1.2 27.25,18.25 | 27.25,17.75 27.25,15.95 27.35,15.85 | R3.2 31.35,15.75 31.55,15.55 31.55,14.95 30.45,13.85 30.45,10.55 31.05,9.95 U$1.4 U$1.15
  Top 0.203: v33.05,14.15 33.35,13.85 C8.2 | v31.55,14.15 31.45,14.05 C9.2 | v28.85,14.15 28.65,14.35 | 28.65,14.35 28.55,14.45 | 28.65,14.35 28.65,14.65 28.65,15.05 | 28.45,14.65 28.45,15.75 | 28.55,15.75 28.55,16.05
  Top 0.508: 27.25,17.75 27.25,18.25 27.25,18.3 | 27.25,18.3 27.25,20.75 26.65,20.75 26.65,14.45 28.55,14.45 | 28.45,14.65 28.65,14.65 | 28.65,15.05 30.05,15.05 30.05,18.32 | RCTL.2 27.25,18.3
  Top 0.813: RSENSE1.2 27.25,17.75 | 27.25,17.75 RSENSE2.2 | RSENSE2.2 29.96,15.75 29.96,18.32 | RCTL.2 29.65,17.75 27.25,17.75 | RSENSE2.2 27.25,17.05 28.45,17.05 | 28.45,17.05 29.65,17.05 | R3.2 28.15,15.75 27.85,16.05 | 28.45,14.65 28.45,17.05
  Bottom 0.254: v33.05,14.15 v31.55,14.15 v28.85,14.15
EB+  (via drill 0.3, 0.4)
  Top 0.152: v3.14,18.01 R4.2 | v4.17,31.75 4.17,31.8 7.46,35.09 16.72,35.09 v17.82,36.19
  Top 0.254: R27.1 9.8,15.45 R18.1 9.25,15.4 8.4,16.25 5.05,16.25 4.73,16.57 4.73,17.57 4.29,18 R4.2
  Top 0.305: RCOP.1 15.9,33.7 17.3,33.7 17.65,34.05 v17.6,34.1
  Top 0.381: RCOP.1 RVMP.1 | v17.6,34.1 26.4,34.1 J3.1
  Bottom 0.152: v3.14,18.01 2.97,18.18 2.97,30.25 4.17,31.45 v4.17,31.75 | v17.82,36.19 17.82,34.59 17.95,34.45
  Bottom 0.305: U3.4 16.35,32.35 16.35,32.85 U3.3
  Bottom 0.381: 25.45,34.45 17.95,34.45 v17.6,34.1 17.25,33.75 17.25,32.95 16.65,32.35 16.35,32.35 16.35,31.35 C1.1 | 25.45,34.45 J3.1 26.55,34.65 26.55,35.95 32.65,35.95 36.15,32.45 36.15,18.55 34.61,17.02 Q5.3 33.92,17.02 34.45,17.55 34.45,19.05 33.94,19.55 Q5.1 34.05,19.55 34.55,20.05 34.55,27.75 34.35,27.95 34.05,28.25 31.9,28.25 31.85,28.2 | Q1.3 31.85,27.02 31.85,28.2 | 31.85,28.2 30.3,29.75 29.85,29.75 25.45,34.15 25.45,34.45
  Bottom 0.813: 34.35,27.95 35.65,27.95 35.65,18.75 34.45,17.55
  pour Bottom (no thermals): 26.65,41.25 37.45,41.25 37.45,17.65 37.45,16.75 26.95,16.75 26.65,16.75
GND  (via drill 0.4)
  Top 0.381: RVINI.2 13.43,26.73 12.35,25.65 12.35,25.05 R15.2 v12.35,23.85 | R16.2 14.04,21.21 Q4.2 15.46,19.79 v18.55,19.79 RSENSE1.1 21.65,15.85 | 21.65,15.85 RSENSE2.1 21.65,13.58 21.23,13.17 | U$2.1 21.23,13.17 | U$2.2 19.96,13.17 | 19.96,13.17 21.23,13.17 | U$2.3 18.77,13.17 19.27,13.17 | 19.27,13.17 19.96,13.17 | R20.2 16.3,14.2 17.95,15.85 21.65,15.85 | R11.1 7.55,23.5 v6.65,23.5 6.65,23.7 Q6.2 | RST_CAP.2 15.35,5.15 14.85,4.65 v14.85,4.25 | 19.27,13.17 v19.27,11.73
  Bottom 0.381: U3.5 14.55,31.85 | C1.2 14.55,30.35 14.55,31.85 | 14.55,31.85 14.55,32.45 U3.11 14.15,35.35 C3.2 | C3.2 12.7,35.75 R1.2 11.42,36.8 9.14,36.8 5.78,33.44 5.78,31.16 4.37,29.74 B-.1 4.35,27.95 U$3.1 5.45,23.5 | R32.2 18.55,10.9 19.27,10.9 | 19.27,10.9 Q8.2 | 5.45,23.5 U$3.38 5.55,13.71 5.55,9.8 6.42,7.71 9.18,4.95 9.21,4.95 11.4,2.77 U2.4 U2.3 14.85,2.77 v14.85,4.25 15.71,5.1 U2.7 | U$3.15 19.45,20.65 18.55,19.75 v18.55,19.79 18.51,19.58 18.51,19.42 17.67,18.59 16.07,18.59 14.39,20.26 U$3.P$1 12.35,22.25 v12.35,23.85 | 5.45,23.5 v6.65,23.5 | C3.2 13.75,36.25 R26.2 17.55,40.05 18.91,40.05 19.01,40.14 20.46,40.14 R24.2 25.05,39.25 25.45,38.85 25.45,37.95 R25.2 | U2.1 17.03,2.77 18.45,1.35 25.45,1.35 26.19,2.09 J7.3 | v19.27,11.73 19.27,10.9
  other vias: 18.55,18.89 18.55,17.99 17.65,17.99 19.35,17.99 19.35,18.89 19.35,19.79 14.45,22.29 14.15,33.69 14.15,32.89 14.15,31.99 14.15,31.19 14.15,30.39 14.15,29.59 12.35,24.87 13.65,22.29 13.65,21.49 14.45,21.49 13.65,20.69 14.45,20.69 16.85,25.29 17.65,25.29 16.85,23.19 16.95,21.69
  pour Bottom: -5.35,46.65 22.65,46.65 22.65,-1.55 -5.35,-1.55
  pour Bottom (no thermals): -5.35,46.25 22.65,46.25 22.65,-1.95 -5.35,-1.95
  pour Top (no thermals): 12.05,34.15 22.95,34.15 22.95,11.35 12.05,11.35
GPIO0  (via drill 0.3)
  Top 0.2: J7.5 27.91,4.37 23.51,4.37 22.59,5.29 v22.59,7.85
  Bottom 0.152: v22.59,7.85 21.4,9.03 21.4,10.74 19.88,12.26 18.67,12.26 18.51,12.42 18.51,13.79 U$3.25
LEAKAGE_IN  (via drill 0.4)
  Top 0.254: T4.3 3.65,19.65 3.65,21.78 2.81,22.62 2.81,24.31 4.25,25.75 8.05,25.75 v8.45,25.35
  Top 0.381: T4.3 2.3,19.45 R7.1
  Bottom 0.254: v8.45,25.35 U$3.4
LEAKAGE_OUT  (via drill 0.4)
  Top 0.2: R12.2 10.35,23.4 11.14,22.61 v11.14,20.59
  Bottom 0.2: v11.14,20.59 v11.15,20.58 11.15,15.95 11.65,15.45 13.05,15.45 13.45,15.05 U$3.30
N$1
  Top 0.381: T4.1 6.05,17.3 T3.2
N$2
  Top 0.2: R6.1 7.55,15.3 T3.1
N$3
  Top 0.254: R2.2 6.15,20.3 T4.2 5.1,20.4 4.75,20.75 4.75,22.55 Q6.3
N$4
  Bottom 0.152: U$3.10 14.45,28.35 14.95,28.85 18.47,28.85 18.75,29.13 D2.3
N$5
  Top 0.2: U$1.5 30.65,9.85 30.1,10.4 30.1,11.95 C4.1 28.6,11.65 26.3,11.65 | R9.2 26.3,11.65 | 26.3,11.65 C6.1
N$6
  Top 0.2: U$1.6 30.25,9.75 29.2,10.8 C5.1 28.15,10.65 26,8.5 26,8.45 | 26,8.45 24.6,9.85 C6.2 | 26,8.45 R5.2
N$7
  Top 0.2: U$1.7 29.68,9.1 C5.2 C7.1 27.35,7.6 R8.2
N$8
  Top 0.2: U$6.3 19.68,26.22 17.6,28.3 RDOP.2
N$9  (via drill 0.4)
  Top 0.2: U$6.1 19.47,27.52 18.75,28.25 18.75,32.15 | 18.75,32.15 18.05,32.85 RCOP.2 | 18.75,32.15 19.35,32.75 v24.85,32.75
  Bottom 0.2: Q1.4 33.25,26.55 32.55,25.85 31.65,25.85 31.35,26.15 31.35,27.75 31.19,27.91 30.67,27.91 26.03,32.55 25.06,32.55 v24.86,32.75 v24.85,32.75
  Bottom 0.381: Q5.4 32.75,15.74 32.25,16.25 32.25,17.65 32.89,18.29 | 32.89,18.29 Q5.2 | Q1.4 33.25,26.45 33.95,25.75 33.95,20.55 33.85,20.45 32.35,20.45 32.15,20.25 32.15,19.77 32.17,19.75 32.17,19 32.89,18.29
N$10  (via drill 0.4)
  Top 0.2: v17.44,31.83 16.74,31.83 16.65,31.74 16.65,29.52 RDOP.1
  Bottom 0.2: Q2.2 24.91,26.61 24.05,25.75 23.15,25.75 22.55,26.35 22.55,31.35 23.25,32.05 23.25,33.65 22.95,33.95 18.33,33.95 17.79,33.41 17.79,31.97 17.66,31.83 v17.44,31.83
  Bottom 0.381: Q2.4 27.45,26.25 | 27.45,26.25 27.05,25.85 25.45,25.85 24.91,26.38 Q2.2 | Q1.2 30.71,26.31 30.25,25.85 27.86,25.85 27.45,26.25
N$11
  Top 0.2: U$1.14 33.85,7.56 R10.1
N$12
  Bottom 0.152: U$3.12 16.45,28.05 16.64,28.24 18.73,28.24 21.43,30.95 21.75,30.95 22.15,31.35 D2.1
N$13
  Top 0.2: U$1.1 32.25,9.73 33.05,10.53 33.05,11.15 33.27,11.38 C8.1
N$14
  Top 0.2: U$1.3 C9.1
N$15
  Top 0.152: R13.2 14.46,24.21 12.41,22.17 R15.1
  Top 0.2: R15.1 Q3.3
N$16
  Top 0.152: Q4.1 16.08,21.07 16.08,22.09 R16.1 15.72,22.37 15.72,24.38 R13.1
N$17
  Top 0.2: U$6.2 19.63,26.88 18.4,28.1 18.4,29.9 17.6,30.7 RVMP.2
N$18
  Top 0.2: U$6.10 27.84,23.62 28.55,22.92 28.55,22.52 RSEL.2
N$19
  Bottom 0.152: U$3.11 15.45,28.25 15.74,28.54 18.6,28.54 19.05,29 19.05,29.65 20.45,31.05 D2.2
N$20
  Top 0.2: U$6.4 19.52,25.57 18.65,26.45 17.88,26.45 RVINI.1
N$21
  Top 0.2: U$6.5 20.83,24.93 20.53,25.22 18.6,25.22 18.39,25.01 CDT.2
N$22
  Top 0.2: U$6.6 20.02,24.27 CCT.2
N$23
  Top 0.2: CCT.1 19.95,22.65 20.93,23.62 U$6.7 21.68,23.65 22.95,23.65 23.45,24.15 23.45,24.85 23.52,24.93 U$6.12 27.97,24.93 28.25,24.65 28.25,23.92 29.05,23.12 RSEL.1 29.65,23.05 30.55,22.15 30.55,20.25 30.78,20.02 RVSS.1 | CCT.1 | CDT.1 CCT.1 | 23.45,27.65 23.45,27.45
  Top 0.61: CVSS.1 22.2,28.9 23.45,27.65 | 23.45,27.45 23.45,24.85
N$24
  Bottom 0.381: Q8.1 19.95,9.1 R32.1 17.1,10.45 R30.1
N$25
  Top 0.2: U$6.11 25.88,24.27 25.65,24.05 25.65,22.55 26.05,22.15 28.1,22.15 28.55,21.7 28.55,20.2 28.75,20 RCTL.1
N$26
  Bottom 0.152: Q1.8 29.48,21.48 30.05,21.48 30.7,21.48 Q1.7 30.78,21.4 30.79,21.39 31.14,21.04 31.23,20.95 31.4,20.56 | Q5.5 27.81,15.77 27.81,15.95 27.81,16.98 Q5.6 | 26.25,21.4 26.21,21.4 Q2.6 | Q5.7 27.81,18.28 27.81,19.15 27.81,19.5 Q5.8 | Q2.8 23.69,21.48 24.42,21.48 24.91,21.48 Q2.7 | Q2.5 27.43,21.48 27.25,21.48 26.65,21.48 | Q1.5 33.22,21.48 32.95,21.48 32.3,21.48 Q1.6
  Bottom 0.61: 32.48,21.85 32.48,21.48 32.95,21.48 | Q1.5 31.23,21.42 31.23,20.95
  Bottom 0.813: Q2.7_8 24.42,21.48 24.42,19.15 | 24.42,19.15 24.42,17.98 | 24.42,17.98 25.7,16.7 | 25.7,16.7 26.45,15.95 26.65,15.95 | 26.65,15.95 27.81,15.95 31.35,15.95 31.45,16.05 31.45,18.66 31.4,18.71 31.4,20.56 31.96,21.12 Q1.6 | Q2.7_8 Q2.5_6 | Q1.5_6 Q1.7_8 Q2.5_6 | Q5.5_6 29.92,17.65 | 29.92,17.65 Q5.7_8 | Q5.7_8 29.55,19.15 29.25,19.15 | 29.25,19.15 27.81,19.15 26.25,19.15 | 26.25,19.15 24.42,19.15 | 26.25,19.15 26.25,21.4 26.25,21.85 26.55,22.15 26.65,22.05 26.65,21.48 26.65,17.85 | 26.65,17.85 26.65,16.85 | 26.65,16.52 26.65,15.95 | Q2.7_8 32.25,23.52 32.25,24.25 | 32.25,24.25 32.25,24.95 30.65,24.95 | 30.65,24.95 27.82,24.95 | 27.82,24.95 23.95,24.95 23.95,18.45 24.42,17.98 | Q5.5_6 30.65,17.25 30.65,21.04 | 30.65,21.04 30.65,21.85 | 30.65,21.85 30.65,24.95 | Q1.5_6 25.45,23.52 25.45,24.35 25.7,24.35 25.7,16.7 | 26.65,16.85 26.25,16.85 26.25,19.15 | Q2.7 25.15,21.42 25.15,17.65 29.92,17.65 | Q5.5_6 27.25,16.52 | 27.25,16.52 26.65,16.52 | 26.65,16.52 26.65,16.85 | 26.65,17.85 27.25,17.85 27.25,16.52 | Q5.6 27.25,17.04 27.25,21.48 | Q5.7 27.82,22.85 | 27.82,22.85 27.82,24.95 | Q2.5_6 26.68,24.25 32.25,24.25 | Q2.5_6 32.05,23.52 32.05,22.85 31.45,22.85 | 31.45,22.85 29.25,22.85 | 29.25,22.85 28.55,22.85 | 28.55,22.85 27.82,22.85 | Q5.7_8 28.55,18.78 28.55,22.85 | 29.25,22.85 29.25,19.15 | Q5.7_8 30.05,18.78 30.05,21.48 | Q1.5_6 32.48,21.85 31.45,21.85 | 31.45,21.85 30.65,21.85 | Q1.5_6 32.48,21.39 30.79,21.39 | 31.45,22.85 31.45,21.85 | 30.65,21.04 31.14,21.04
N$27
  Top 0.2: U$6.13 28.12,25.57 28.65,25.05 28.65,24.25 29,23.9 30.3,23.9 30.65,23.55 30.65,22.55 31.05,22.15 31.05,22.1 CVC3.1 33.45,23.1 RVC3.1
N$28
  Top 0.2: U$6.14 28.22,26.22 CVC2.1 29.7,24.75 31.75,24.75 RVC2.1
N$29
  Top 0.2: U$6.15 25.93,26.88 25.75,27.05 25.75,28.25 26.2,28.7 RVC1.1 31.65,28.7 CVC1.1
N$30
  Bottom 0.254: R30.2 14.9,11.8 14.45,12.25 U$3.29
N$31
  Bottom 0.381: R26.1 18.25,37.85 D2.4
N$32
  Top 0.381: Q3.2 13.3,17.61 R14.2 13.2,15.54 R27.2
N$33
  Bottom 0.381: D2.6 22.65,37.85 R25.1
N$34
  Bottom 0.381: D2.5 19.65,38.15 R24.1
N$35
  Bottom 0.254: D1.A 23.55,11.6 24,12.05 U$4.P$1
  Bottom 0.381: Q8.3 22.85,10.65 22.85,11.1 D1.A
OUT-  (via drill 0.4)
  Top 0.152: U$2.5 17.44,7.08 17.35,7.08 | U$2.9 17.98,7.76 18.66,7.08 U$2.6 | U$2.7 19.88,7.08 20.95,7.08 U$2.8
  Top 0.2: R14.1 11.5,17 v12.05,16.45 | v23.55,13.85 23.55,11.25 22.55,10.25 19.85,10.25 19.25,9.65 19.25,7.75 19.15,7.65
  Top 0.254: R18.2 11.3,17.1 11.5,17.3 R14.1 11.5,18.65 Q3.1
  Top 0.406: U$2.9 17.35,7.42 17.35,7.08 17.35,6.33 17.57,6.11 17.57,5.35 17.57,5.13 18.55,4.15 18.65,4.25 J4.1 20.4,4.6 21.11,5.31 U$2.8
  Top 0.813: J4.1 19.75,4.25 19.75,7.65 19.15,7.65 17.57,7.65 17.57,7.15 | 17.57,7.15 17.57,6.45 | 17.57,6.45 17.57,5.35 | J4.1 20.05,7.15 19.05,7.15 | 19.05,7.15 17.57,7.15 | J4.1 20.05,6.45 18.45,6.45 | 18.45,6.45 18.05,6.45 | 18.05,6.45 17.57,6.45 | 20.4,4.6 20.4,9.32 U$2.9 20.65,9.32 20.65,3.95 19.05,3.95 19.05,4.95 | 19.05,4.95 19.05,5.55 | 19.05,5.55 19.05,7.15 | 18.05,6.45 18.05,4.95 19.05,4.95 | 19.05,5.55 18.45,5.55 18.45,6.45
  Bottom 0.2: v12.05,16.45 12.55,15.95 19.35,15.95 21.45,13.85 v23.55,13.85
OUT_BASE
  Top 0.381: U$2.4 16,13.05 R20.1 R19.1
OUT_CONTROL  (via drill 0.4)
  Top 0.2: R19.2 13.85,11 13.85,11.26 v13.94,11.35
  Bottom 0.2: v13.94,11.35 13.05,11.35 12.45,11.95 U$3.31
RST  (via drill 0.3, 0.35)
  Top 0.152: v11.75,33.55 8.55,30.35 7.65,30.35 7.25,29.95 v7.25,28.35 6.23,28.35 | v13.44,6.19 13.9,6.19 | v10.95,4.49 10.9,4.45 9.15,4.45
  Top 0.2: 6.23,28.35 2.41,24.53 2.41,22.47 3.09,21.79 3.09,20.35 1.45,20.35 0.95,19.85 0.95,15.69 4.99,11.65 4.99,8.61 9.15,4.45 | J7.4 26.16,2.25 24.12,2.25 22.81,0.94 17.46,0.94 16.96,1.44 14.01,1.44 v10.96,4.49 v10.95,4.49
  Top 0.381: RST_CAP.1 13.9,6.19 R28.1
  Bottom 0.152: U3.9 12.05,33.35 11.85,33.55 v11.75,33.55 | v7.25,28.35 7.45,28.15 U$3.3 | v13.44,6.19 12.65,6.19 v10.95,4.49
RT
  Bottom 0.381: U3.10 12.4,33.85 11.55,34.7 R1.1
RX  (via drill 0.4)
  Top 0.2: J7.1 21.85,1.75 17.75,1.75 17.16,2.34 14.1,2.34 11.96,4.48 11.96,6.64 12.36,7.04
  Top 0.203: 12.36,7.04 12.36,9.24 v9.65,11.95
  Bottom 0.152: U$3.34
  Bottom 0.203: U$3.34 9.44,12.06 9.6,11.9 v9.65,11.95
SCL  (via drill 0.4)
  Top 0.203: R22.1 7.45,13.2 v7.45,12.25 | U$1.11 v31.05,5.05 | v16.35,6.25 14.65,6.25 v14.65,6.21
  Bottom 0.203: U$3.36 v7.45,12.25 7.45,11.75 8.25,10.95 11.35,10.95 12.45,9.85 12.45,7.25 12.55,7.15 14.25,7.15 14.45,7.35 | 14.45,7.35 14.45,8.34 U2.6 | v31.05,5.05 30.35,5.75 23.05,5.75 22.15,6.65 16.75,6.65 v16.35,6.25 | v14.65,6.21 14.45,6.41 14.45,7.35
SDA  (via drill 0.4)
  Top 0.203: v10.45,12.15 10.45,12.2 R21.1 11.6,10.8 12.75,9.65 12.75,6.85 12.35,6.45 12.35,4.65 12.71,4.29 12.75,4.29 13.95,3.09 15.68,3.09 v16.37,3.78 | U$1.12 31.45,5.45 31.85,5.05 v31.95,5.05
  Bottom 0.203: U$3.33 v10.45,12.15 10.45,11.55 10.65,11.35 11.95,11.35 13.15,10.15 13.15,8.37 U2.5 | v31.95,5.05 31.84,5.05 31.28,4.49 30.51,4.49 29.61,5.39 22.9,5.39 22,6.29 17.29,6.29 16.37,5.37 v16.37,3.78
SW
  Bottom 0.381: U3.6 12.19,31.85 12.11,31.77 12.12,31.77 | 9.48,30.74 C2.2 9.52,30.78 9.48,30.74
  Bottom 0.5: 12.12,31.77 11.2,30.85
  Bottom 0.61: 11.2,30.85 9.91,30.33 C2.2 | L1.P$1 8.62,31.57 9.48,30.74
THERMISTOR
  Top 0.2: R10.2 33.95,9.95 35.25,9.95 36.15,9.95 38.35,12.15 38.35,13.25 39.45,14.35 39.85,15.32 39.88,15.35 39.88,18.32 39.45,18.75 39.45,22.15 37.49,24.11 J8.3
  Top 0.203: U$1.9 30.25,4.45 30.35,4.35 32.25,4.35 35.25,7.35 35.25,9.95
TX  (via drill 0.4)
  Top 0.2: J7.2 22.76,1.39 17.61,1.39 17.11,1.89 14.05,1.89 11.57,4.37 11.57,6.75 11.97,7.15
  Top 0.203: v8.45,11.91 9.15,11.21 9.85,11.21 11.97,9.09 11.97,7.15
  Bottom 0.203: U$3.35 v8.45,11.91
VDD  (via drill 0.4, 0.5)
  Top 0.381: R21.2 13.3,10.65 13.7,10.25 13.7,9.15 R28.2 16.45,8.1 v16.45,8.25 | R22.2 9,14.2 9.3,14.5 9.3,14.55 13.1,14.55 13.3,14.35 R21.2 | R21.2 13.3,13.5 14.25,14.45 14.25,14.65 15.25,15.65 | 15.25,15.65 15.3,15.7 R17.1 | 15.25,15.65 14.55,16.35 14.55,19.55 14.18,19.92 9.98,19.92 9.75,20.15 R29.2 9.88,20.3 10.65,21.06 10.65,22.45 10.55,22.55 8.65,22.55 | v38.36,25.9 arc90 27.77,36.49 19.04,36.49 17.14,34.59 16.76,34.59 v16.55,34.45 | R23.2 1.95,24.9 1.95,21.5 R7.2
  Top 0.508: v16.55,34.45 13.45,34.45 | 13.45,34.45 11.65,34.45 v10.75,33.55 9.85,33.55 6.4,30.1 R23.2 | 8.65,22.55 8.65,24.35 11.75,27.45 12.55,27.45 13.35,28.25 13.35,34.35 13.45,34.45
  Bottom 0.381: U3.8 11.45,32.85 v10.75,33.55 10.65,33.55 | 9.97,34.23 9.82,34.23 9.82,34.28 L1.P$2 | U3.2 16.35,33.35 16.55,33.55 16.55,33.85 | U3.1 16.55,33.85 | C3.1 v16.55,34.45 16.55,33.85 | v16.45,8.25 16.75,8.25 16.85,8.35 U2.8 16.97,7.92 17.65,7.25 23.95,7.25 26,9.3 | v38.36,25.9 38.36,21.22 37.48,20.34 J8.6 | D1.C 26,9.3 | 26,9.3 U$4.P$2
  Bottom 0.508: U$3.2 6.39,26.91 6.39,32.45 7.99,34.05 9.55,34.05 9.72,34.22 L1.P$2
  Bottom 0.61: 10.65,33.55 9.97,34.23
WTR-SENS  (via drill 0.3)
  Top 0.152: v8.76,17.06 7.76,17.06 R6.2 | v33.63,14.74 33.63,14.34 34.33,13.64 38.14,13.64 39.1,14.6 39.45,15.46 39.55,15.54 39.55,18.1 38.15,19.49 38.15,20.87 J8.5 | 10.65,18.05 10.45,17.85 7.65,17.85
  Top 0.2: v13.95,16.57 14.05,16.67 14.05,19.21 13.78,19.48 10.85,19.48 10.65,19.28 10.65,18.05
  Top 0.254: R2.1 7.65,17.85 R6.2
  Bottom 0.152: v13.95,16.57 19.46,16.57 21.33,14.7 33.59,14.7 v33.63,14.74
WTR_MEASURE_ON1
  Top 0.381: R12.1 R11.2 6.95,22.4 Q6.1
WTR_MEASURE_PULLUP1
  Top 0.152: R4.1 3.73,16.3 T3.3 | R4.1

### Text on the board
tPlace: DiveTeam | v6.5 | OUT+ | BATT+ | BATT- | OUT-